# EAGLE design 7805 (EAGLE 7.7.0)
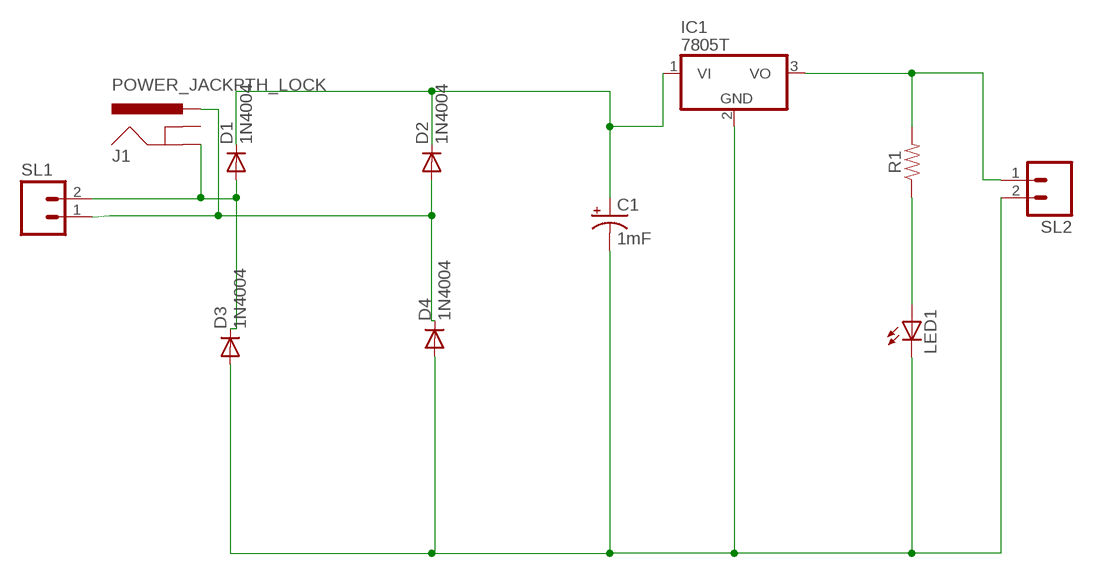
[diagram p0: schematic, sheet 1]

## Parts
C1  1mF  1000UF-RADIAL-5MM-25V-20%  [CPOL-RADIAL-5MM-10MM]
D1  1N4004  [DO41-10]
D2  1N4004  [DO41-10]
D3  1N4004  [DO41-10]
D4  1N4004  [DO41-10]
IC1  7805T  [TO220H]
J1  POWER_JACKPTH_LOCK  [POWER_JACK_PTH_LOCK]
LED1  LED5MM  [LED5MM]
R1  RESISTORAXIAL-0.3  [AXIAL-0.3]
SL1  M02  [02P]
SL2  M02  [02P]

## Nets
N$1: D2.A D4.C J1.PWR SL1.1
N$2: D4.A
N$3: C1.- D3.A IC1.2(GND) LED1.K(C) SL2.2
N$4: IC1.3(VO) R1.P$2 SL2.1
N$5: C1.+ D1.C D2.C IC1.1(VI)
N$6: D1.A D3.C SL1.2
N$7: LED1.A R1.P$1
N$8: J1.GND
Unconnected: J1.GNDBREAK

## Library data of the parts
C1 = SparkFun-Capacitors:1000UF: 1,000µF/1mF ceramic capacitors A capacitor is a passive two-terminal electrical component used to store electrical energy temporarily in an electric field. CAP-08070; PROD_ID: CAP-09538
D1-D4 = adafruit:1N4004: DIODE General purpose 1N400x type rectifier (With bigger pads) http://www.ladyada.net/library/pcb/eaglelibrary.html
IC1 = adafruit:78*: Positive VOLTAGE REGULATOR Added bigger pads to the TO-92 package
J1 = SparkFun-Connectors:POWER_JACK: Power Jack Connector This is the standard 5.5mm barrel jack for power. The PTH is the most common, proven, reliable, footprint. The Slot footprint only works if the mill layer is transmitted to the PCB fab house so be warned. Here are the connectors we sell at SparkFun: DC Barrel Power Jack/Connector <https://www.sparkfun.com/products/119> (PRT-00119) DC Barrel Power Jack/Connector (SMD) <https://www.sparkfun.com/products/12748> (PRT-12748) DC Barrel Jack Adapter - Breadboard Compatible <https://www.sparkfun.com/products/10811> (PRT-10811) It is used on this SparkFun product (and many, many others): SparkFun RedBoard - Programmed with Arduino <https://www.sparkfun.com/products/12757> (DEV-12757) Also, if you need a mating power supply or connector, please check these out: Wall Adapter Power Supply - 9VDC 650mA <https://www.sparkfun.com/products/298> (TOL-00298) DC Barrel Jack Adapter - Male <https://www.sparkfun.com/products/10287> (PRT-10287); PROD_ID: CONN-08197; SF_ID: PRT-00119
LED1 = adafruit:LED: LED OSRAM: - CHIPLED LG R971, LG N971, LY N971, LG Q971, LY Q971, LO R971, LY R971 LH N974, LH R974 LS Q976, LO Q976, LY Q976 LO Q996 - Hyper CHIPLED LW Q18S LB Q993, LB Q99A, LB R99A - SideLED LS A670, LO A670, LY A670, LG A670, LP A670 LB A673, LV A673, LT A673, LW A673 LH A674 LY A675 LS A676, LA A676, LO A676, LY A676, LW A676 LS A679, LY A679, LG A679 - Hyper Micro SIDELED® LS Y876, LA Y876, LO Y876, LY Y876 LT Y87S - SmartLED LW L88C, LW L88S LB L89C, LB L89S, LG L890 LS L89K, LO L89K, LY L89K LS L896, LA L896, LO L896, LY L896 - TOPLED LS T670, LO T670, LY T670, LG T670, LP T670 LSG T670, LSP T670, LSY T670, LOP T670, LYG T670 LG T671, LOG T671, LSG T671 LB T673, LV T673, LT T673, LW T673 LH T674 LS T676, LA T676, LO T676, LY T676, LB T676, LH T676, LSB T676, LW T676 LB T67C, LV T67C, LT T67C, LS T67K, LO T67K, LY T67K, LW E67C LS E67B, LA E67B, LO E67B, LY E67B, LB E67C, LV E67C, LT E67C LW T67C LS T679, LY T679, LG T679 LS T770, LO T770, LY T770, LG T770, LP T770 LB T773, LV T773, LT T773, LW T773 LH T774 LS E675, LA E675, LY E675, LS T675 LS T776, LA T776, LO T776, LY T776, LB T776 LHGB T686 LT T68C, LB T68C - Hyper Mini TOPLED® LB M676 - Mini TOPLED Santana® LG M470 LS M47K, LO M47K, LY M47K Source: http://www.osram.convergy.de/
R1 = SparkFun-Resistors:RESISTOR: Generic Resistor Package
SL1 SL2 = con-amp-quick:M02: AMP QUICK CONNECTOR; OC_FARNELL: unknown; OC_NEWARK: unknown

## Board
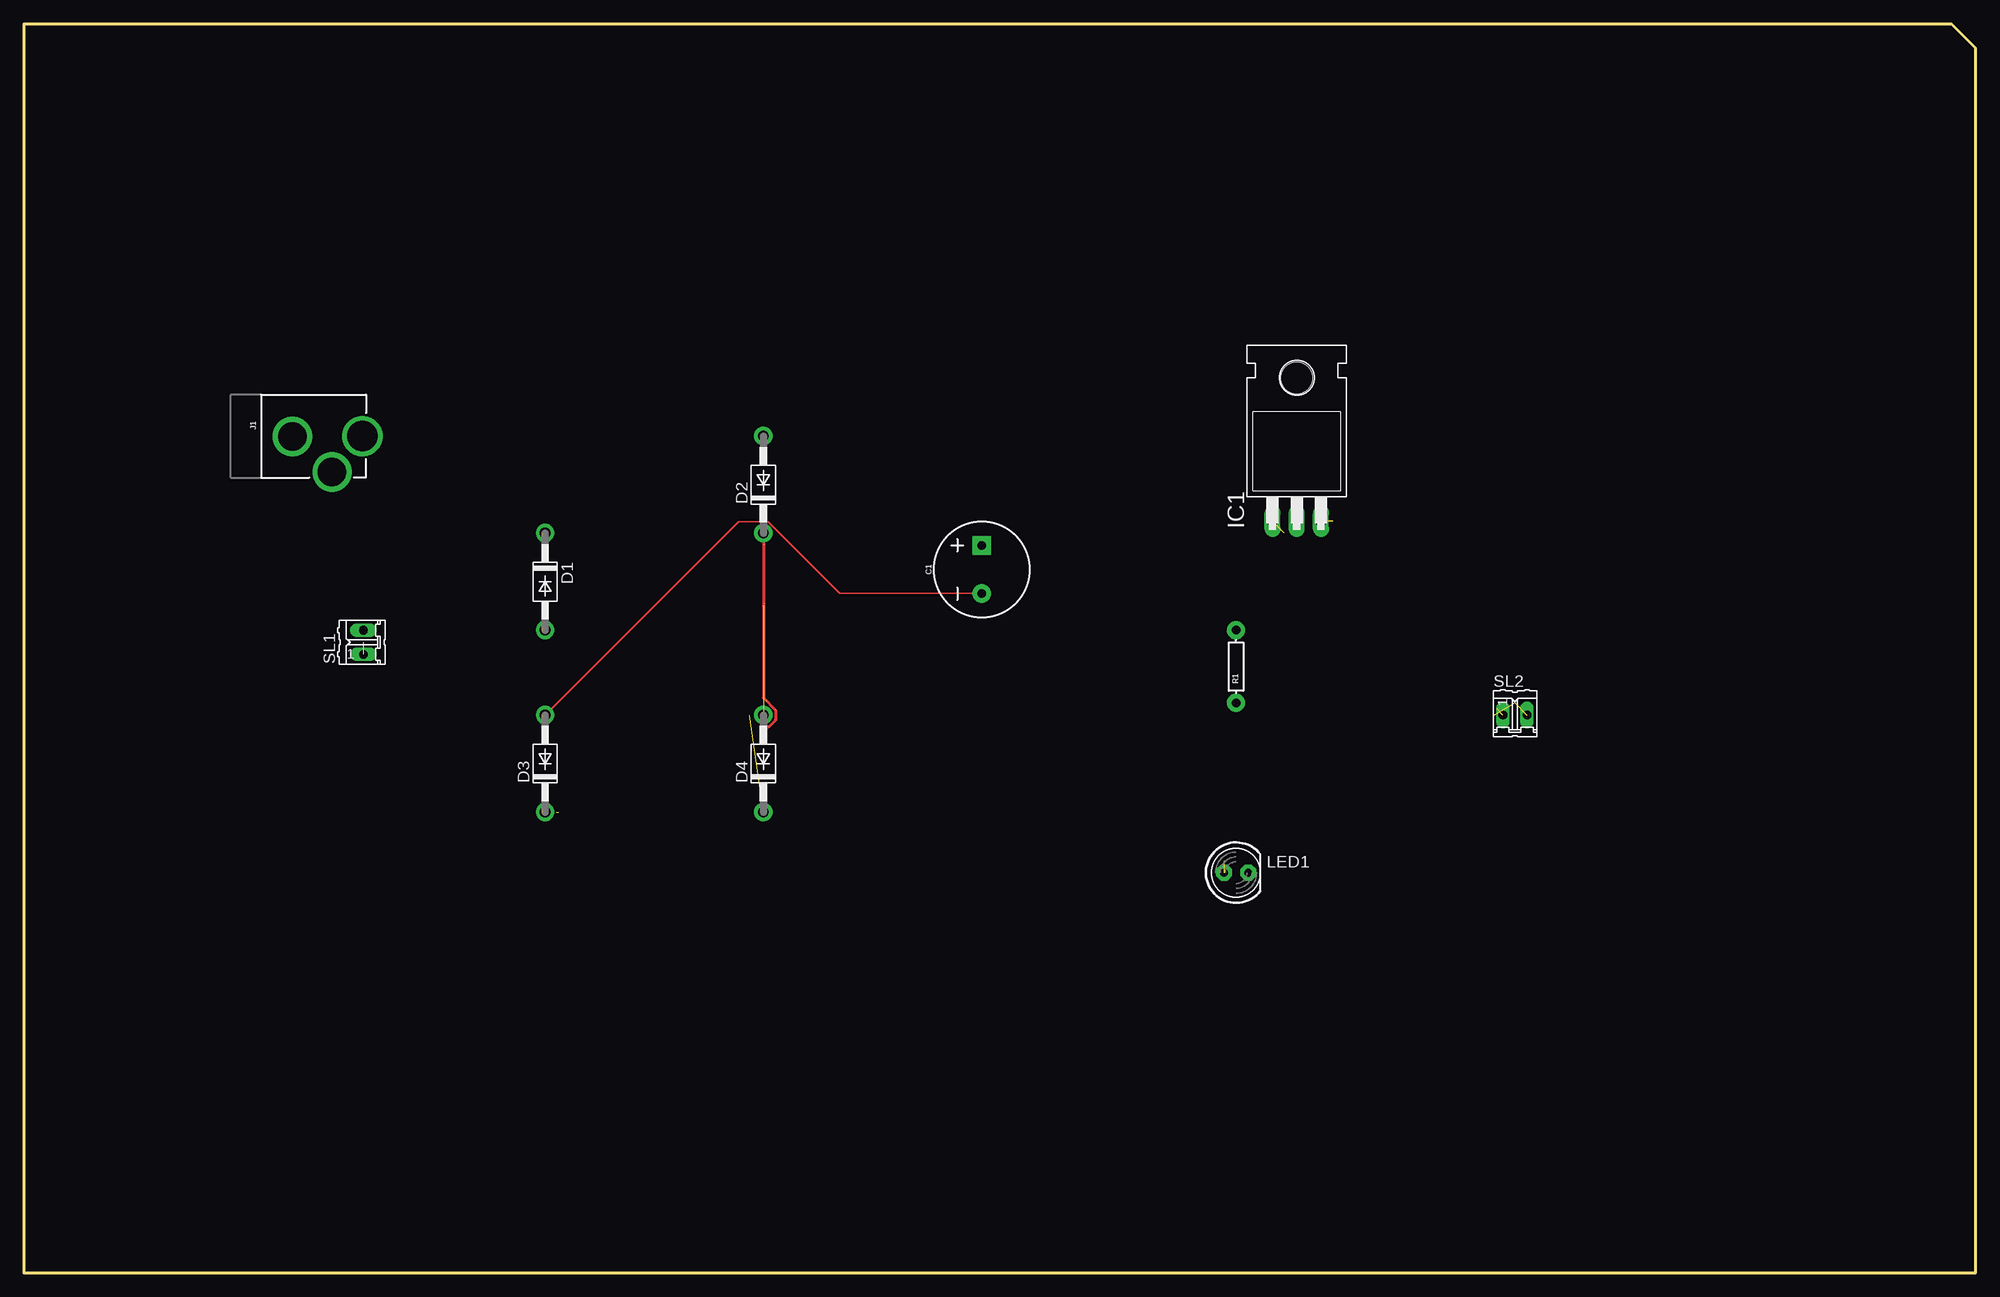
[diagram p1: board, top side]
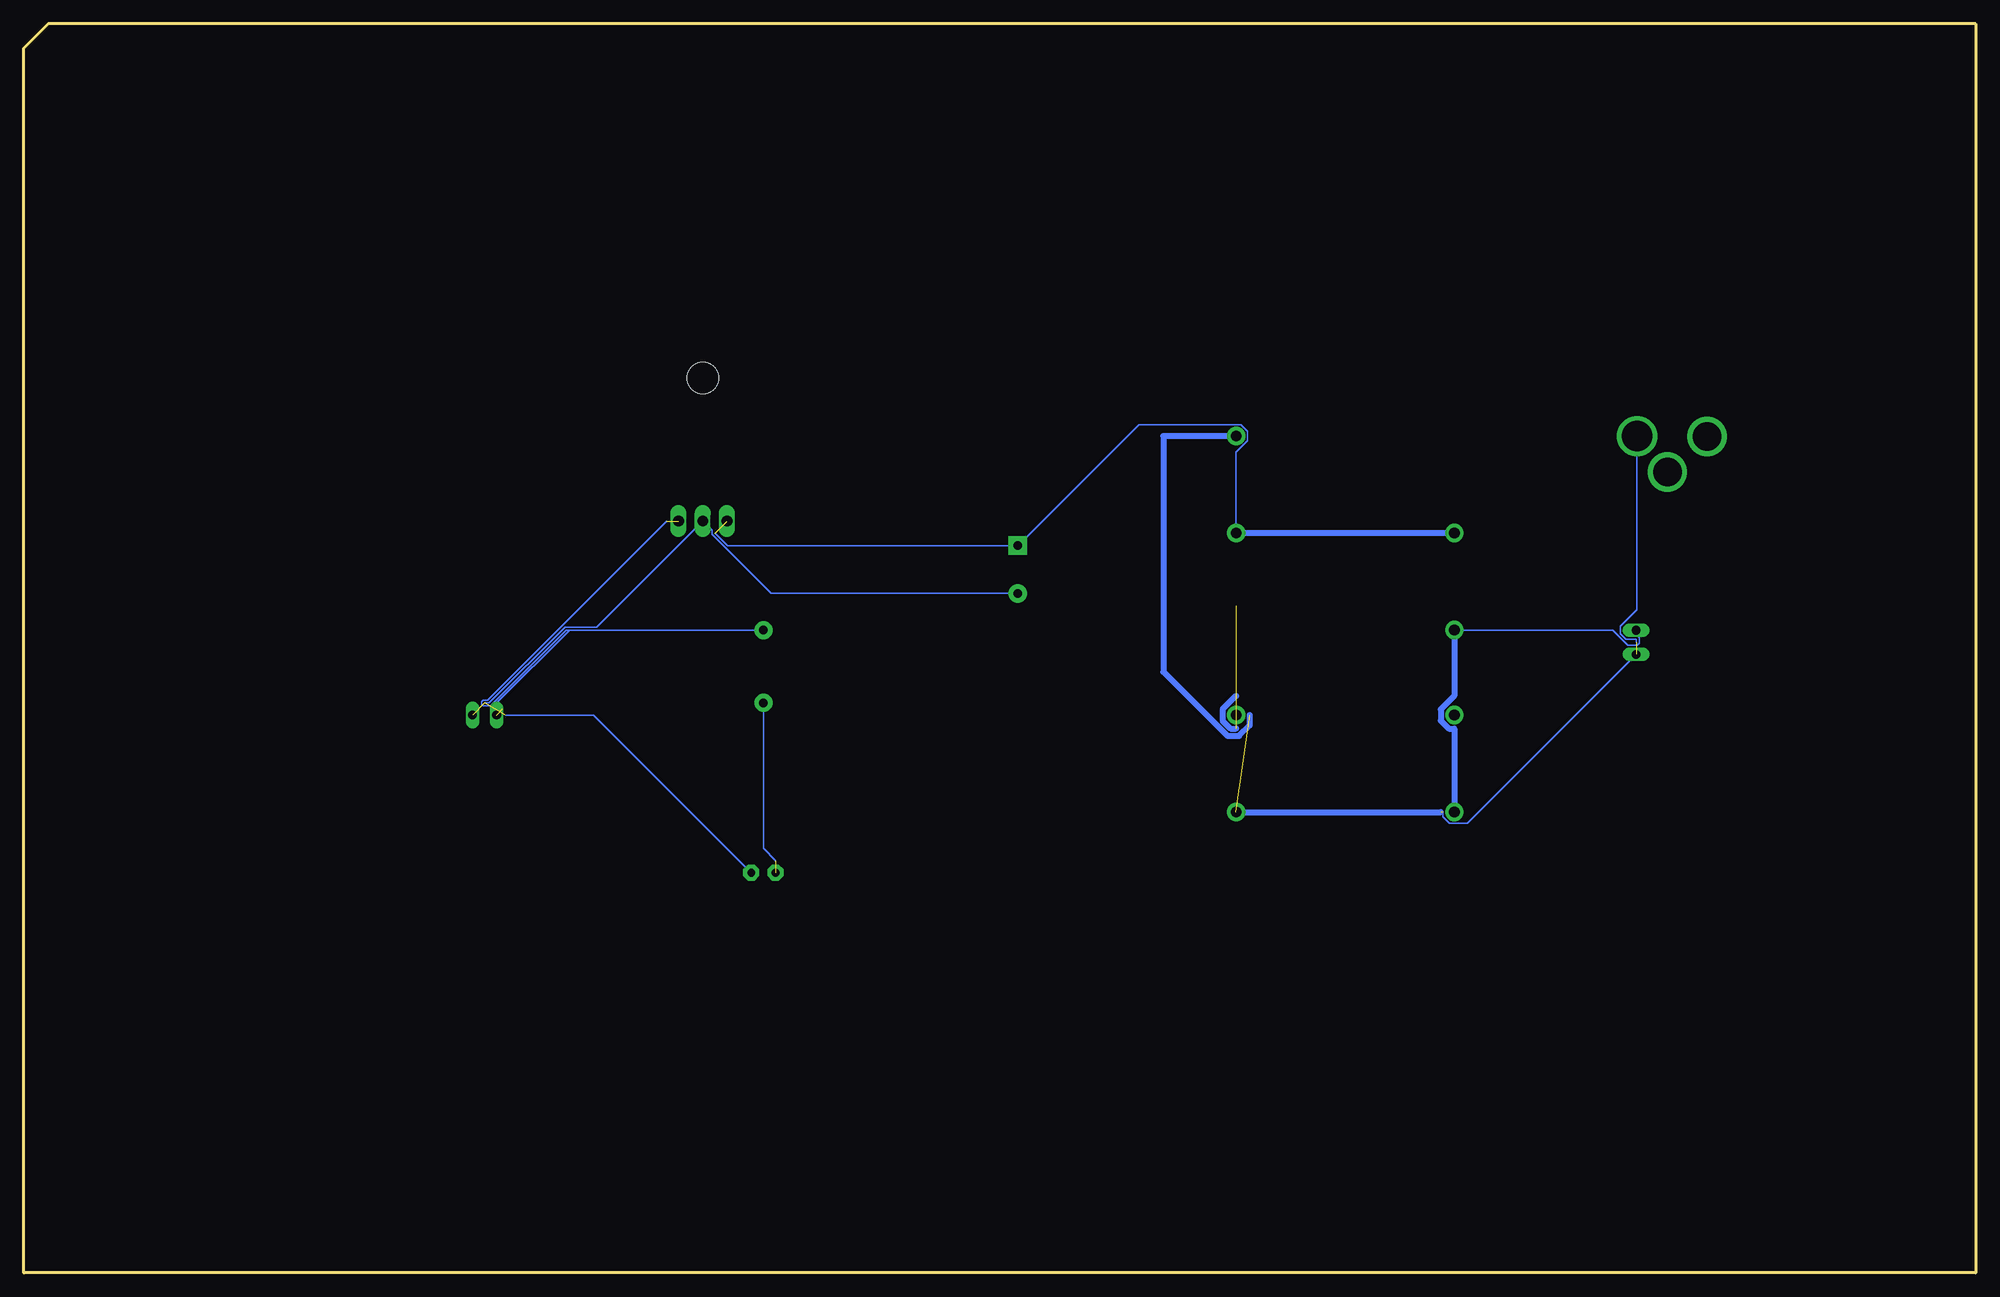
[diagram p2: board, bottom side, seen from below]

Size 204.47 x 130.81 mm. Coordinates in mm from the lower left corner, seen from the top.
Outline: 0,130.81 0,0 204.47,0 204.47,128.27 201.93,130.81 0,130.81
Copper layers (1*16): Top 0.035mm / dielectric 1.5mm / Bottom 0.035mm
Design rules "default": minimum track width 6mil, minimum drill 0.35mm, track to track 6mil, track to pad 6mil, pad to pad 6mil, via to via 6mil, smd to smd 6mil, copper to edge 40mil, drill to drill 6mil, minimum pad ring 10mil, minimum via ring 8mil, stop-mask expansion 4mil, vias tented up to drill 0mil, thermal gap 10mil

### Footprints (pad centres in the part's own frame; a part is rotated, then mirrored left to right if it is on the bottom)
CPOL-RADIAL-5MM-10MM = drill 0.9 pad 1.93 square: + 2.5,0 | drill 0.9 pad 1.93: - -2.5,0
DO41-10 = drill 1.118 pad 1.93: A 5.08,0; C -5.08,0
TO220H = drill 1.118 long: 1 -2.54,-10.16; 2 0,-10.16; 3 2.54,-10.16 | hole 3.302: 0,4.826
POWER_JACK_PTH_LOCK = drill 2.997 pad 4.115: GND 0.025,6.557; GNDBREAK 3.762,10.7 | drill 3.2 pad 4.115: PWR 0,13.878
LED5MM = drill 0.813 pad 1.676 octagon: A -1.27,0; K 1.27,0
AXIAL-0.3 = drill 0.9 pad 1.88: P$1 -3.81,0; P$2 3.81,0
02P = drill 0.914 long: 1 -1.27,0; 2 1.27,0

### Placement (x,y rotation side)
C1  100.33,73.66 90 top
D1  54.61,72.39 270 top
D2  77.47,82.55 90 top
D3  54.61,53.34 90 top
D4  77.47,53.34 90 top
IC1  133.35,88.9 0 top
J1  21.59,87.63 270 top
LED1  127,41.91 0 top
R1  127,63.5 90 top
SL1  35.56,66.04 90 top
SL2  156.21,58.42 0 top

### Tracks (layer width: path | path; a pad name or v marks a point on that pad's centre or on a via)
N$1  (3 unrouted)
  Bottom 0.152: J1.PWR 35.47,69.44 37.21,67.7 37.21,66.92 36.66,66.37 35.56,66.37 35.56,66.04 | 55.8,48.26 55.8,47.77 55.1,47.07 53.26,47.07 SL1.1
  Bottom 0.61: D4.C 56.03,48.26 | D2.A 85.09,87.63 85.09,62.95 78.38,56.24 77.15,56.24 76.05,57.34 76.05,58.42
N$3  (2 unrouted)
  Top 0.152: C1.- 85.47,71.16 77.96,78.66 74.85,78.66 D3.A
  Bottom 0.152: C1.- 126.2,71.16 132.38,77.34 132.38,77.77 IC1.2 144.47,67.61 147.78,67.61 155.71,59.69 156.21,59.69 | LED1.K 144.78,58.42 154,58.42
N$4  (2 unrouted)
  Bottom 0.152: 154.3,59.05 154.94,59.69 147.32,67.31 R1.P$2 147.66,67.31 155.58,59.38 156.34,59.38 156.51,59.56 156.51,59.82 156.34,60 155.91,60 137.16,78.74
N$5  (2 unrouted)
  Top 0.305: 77.47,57.15 78,57.15 78.74,57.89 78.74,58.95 77.47,60.22 77.47,69.85 D2.C
  Bottom 0.152: D2.C 77.47,85.94 76.28,87.14 76.28,88.12 76.98,88.82 87.67,88.82 C1.+ 130.77,76.16 132.08,77.47
  Bottom 0.61: 77.47,57 78.06,57 78.89,57.83 78.89,59.01 77.47,60.43 | D1.C D2.C
N$6
  Bottom 0.152: D1.A 38.03,67.31 36.46,65.73 35.43,65.73 35.25,65.91 35.25,66.5 35.56,66.8 SL1.2
  Bottom 0.61: D1.A 54.61,60.43 56.03,59.01 56.03,57.83 55.2,57 54.61,57 D3.C
N$7  (1 unrouted)
  Bottom 0.152: R1.P$1 127,44.45 125.73,43.18